# Altium schematic sheet Matrix.SchDoc
size A3; SheetNumber: 5; SheetTotal: 6
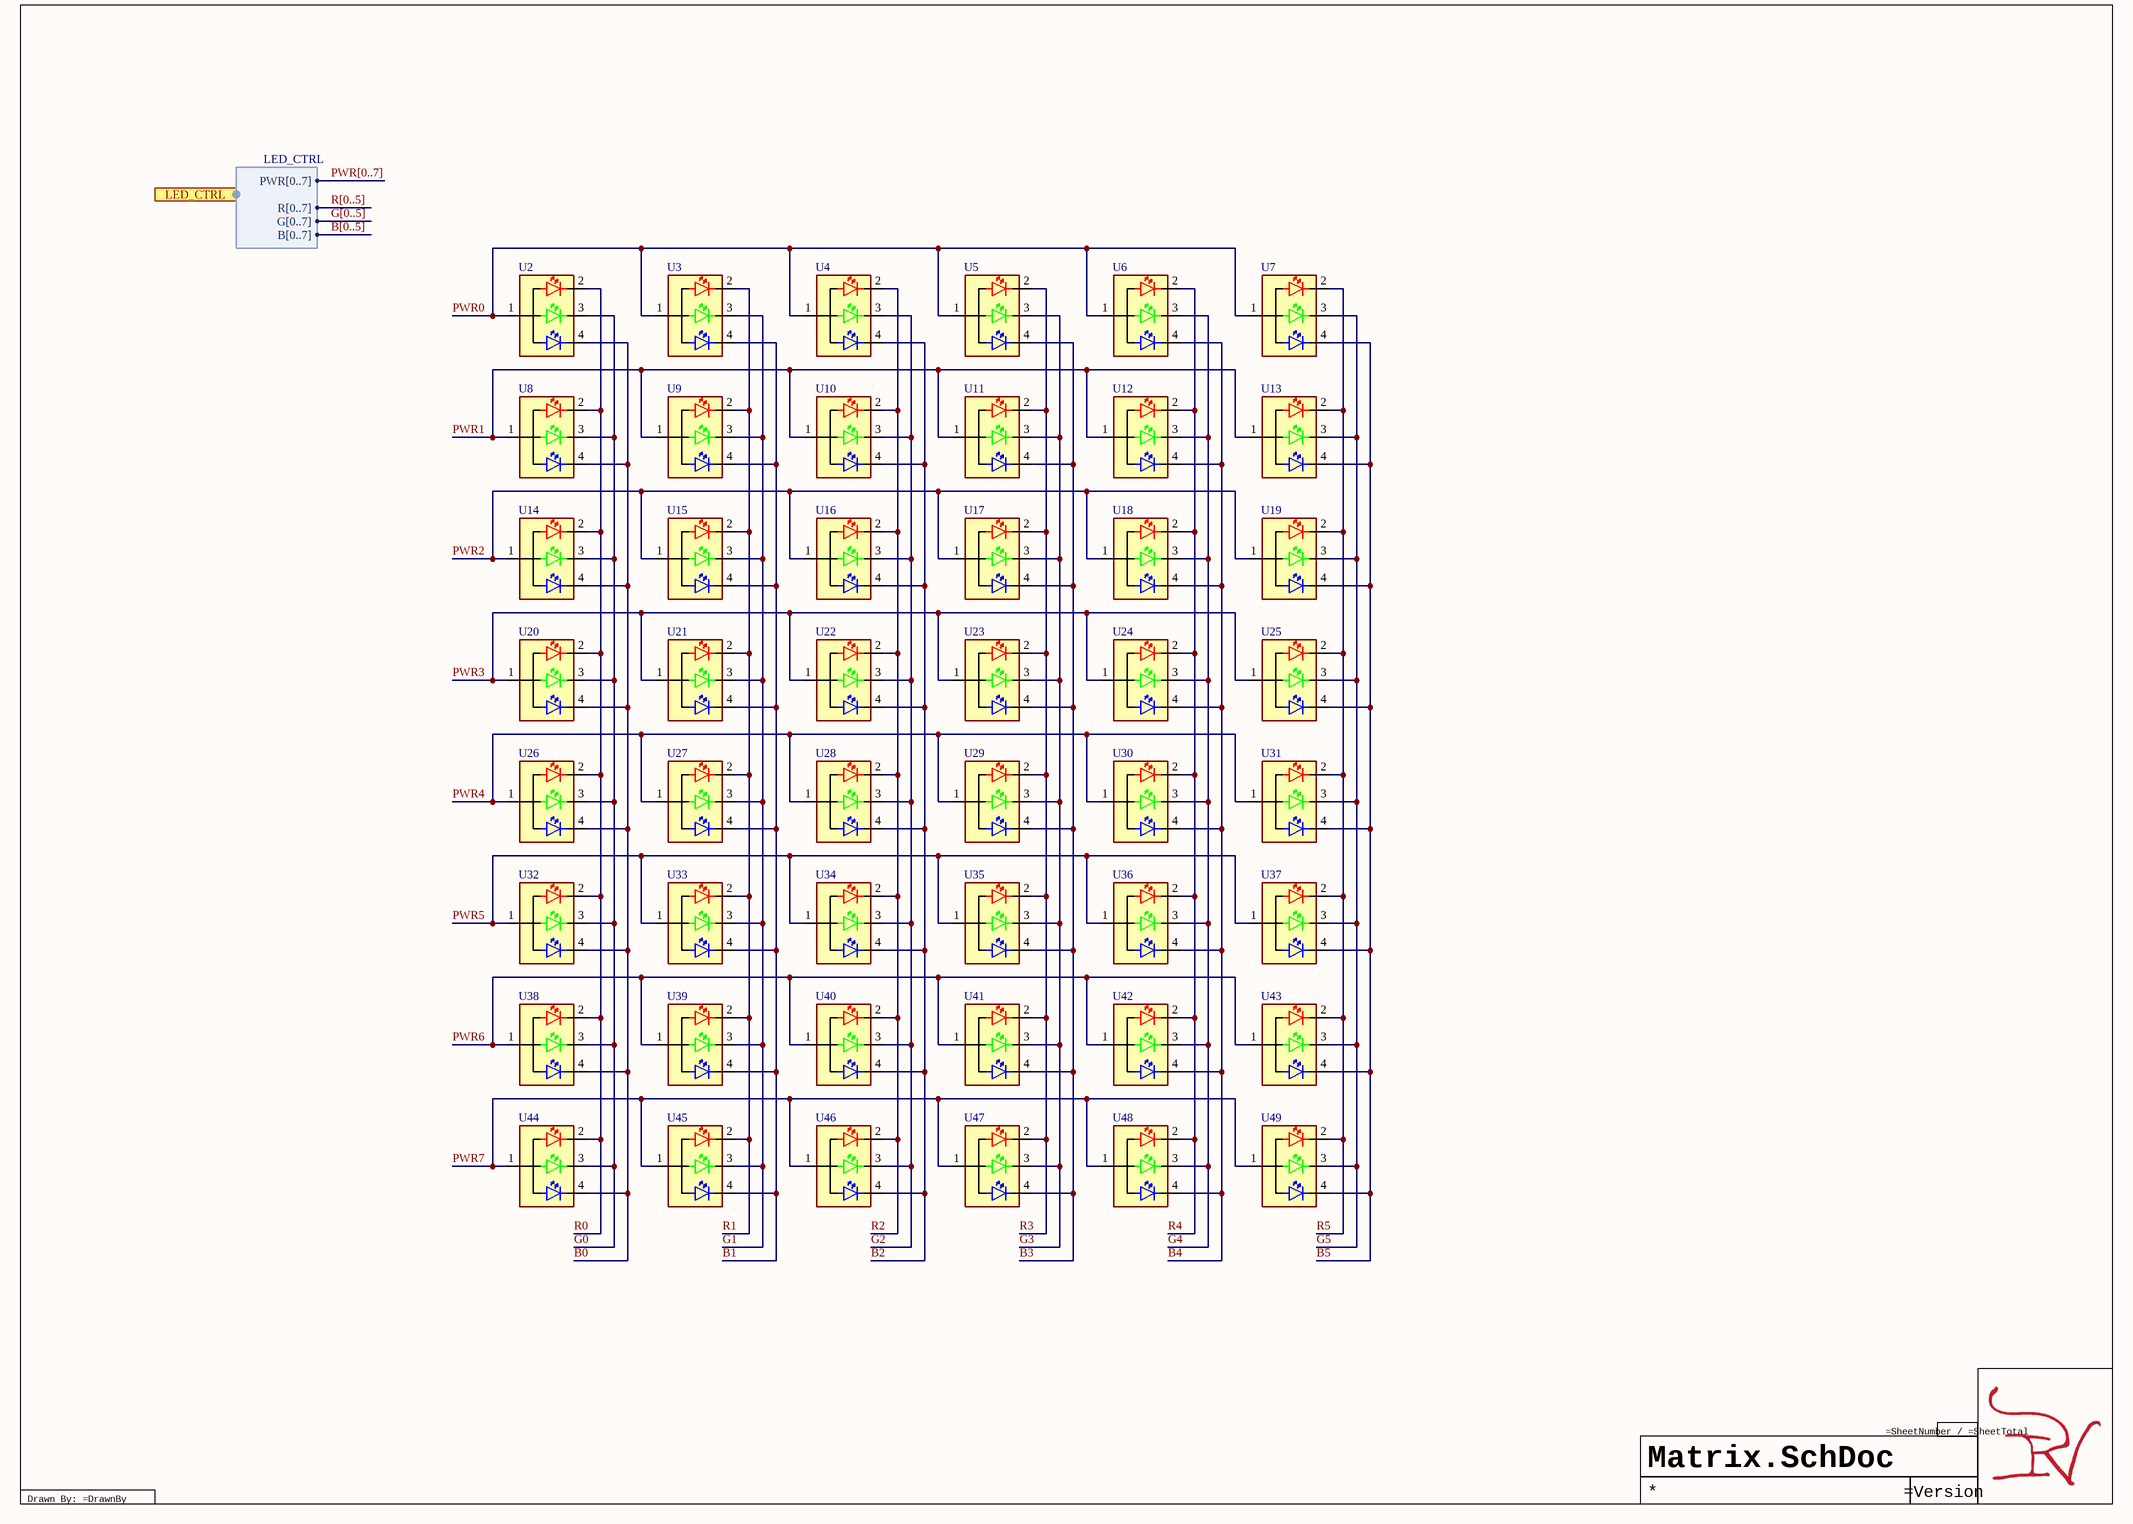
[diagram p0: Matrix.SchDoc]

## Parts
U2  B36J3RGB-F6C0001H4U1930  [B36J3RGB-F6C0001H4U1930-Footprint-1]  (value not drawn)
U3  B36J3RGB-F6C0001H4U1930  [B36J3RGB-F6C0001H4U1930-Footprint-1]  (value not drawn)
U4  B36J3RGB-F6C0001H4U1930  [B36J3RGB-F6C0001H4U1930-Footprint-1]  (value not drawn)
U5  B36J3RGB-F6C0001H4U1930  [B36J3RGB-F6C0001H4U1930-Footprint-1]  (value not drawn)
U6  B36J3RGB-F6C0001H4U1930  [B36J3RGB-F6C0001H4U1930-Footprint-1]  (value not drawn)
U7  B36J3RGB-F6C0001H4U1930  [B36J3RGB-F6C0001H4U1930-Footprint-1]  (value not drawn)
U8  B36J3RGB-F6C0001H4U1930  [B36J3RGB-F6C0001H4U1930-Footprint-1]  (value not drawn)
U9  B36J3RGB-F6C0001H4U1930  [B36J3RGB-F6C0001H4U1930-Footprint-1]  (value not drawn)
U10  B36J3RGB-F6C0001H4U1930  [B36J3RGB-F6C0001H4U1930-Footprint-1]  (value not drawn)
U11  B36J3RGB-F6C0001H4U1930  [B36J3RGB-F6C0001H4U1930-Footprint-1]  (value not drawn)
U12  B36J3RGB-F6C0001H4U1930  [B36J3RGB-F6C0001H4U1930-Footprint-1]  (value not drawn)
U13  B36J3RGB-F6C0001H4U1930  [B36J3RGB-F6C0001H4U1930-Footprint-1]  (value not drawn)
U14  B36J3RGB-F6C0001H4U1930  [B36J3RGB-F6C0001H4U1930-Footprint-1]  (value not drawn)
U15  B36J3RGB-F6C0001H4U1930  [B36J3RGB-F6C0001H4U1930-Footprint-1]  (value not drawn)
U16  B36J3RGB-F6C0001H4U1930  [B36J3RGB-F6C0001H4U1930-Footprint-1]  (value not drawn)
U17  B36J3RGB-F6C0001H4U1930  [B36J3RGB-F6C0001H4U1930-Footprint-1]  (value not drawn)
U18  B36J3RGB-F6C0001H4U1930  [B36J3RGB-F6C0001H4U1930-Footprint-1]  (value not drawn)
U19  B36J3RGB-F6C0001H4U1930  [B36J3RGB-F6C0001H4U1930-Footprint-1]  (value not drawn)
U20  B36J3RGB-F6C0001H4U1930  [B36J3RGB-F6C0001H4U1930-Footprint-1]  (value not drawn)
U21  B36J3RGB-F6C0001H4U1930  [B36J3RGB-F6C0001H4U1930-Footprint-1]  (value not drawn)
U22  B36J3RGB-F6C0001H4U1930  [B36J3RGB-F6C0001H4U1930-Footprint-1]  (value not drawn)
U23  B36J3RGB-F6C0001H4U1930  [B36J3RGB-F6C0001H4U1930-Footprint-1]  (value not drawn)
U24  B36J3RGB-F6C0001H4U1930  [B36J3RGB-F6C0001H4U1930-Footprint-1]  (value not drawn)
U25  B36J3RGB-F6C0001H4U1930  [B36J3RGB-F6C0001H4U1930-Footprint-1]  (value not drawn)
U26  B36J3RGB-F6C0001H4U1930  [B36J3RGB-F6C0001H4U1930-Footprint-1]  (value not drawn)
U27  B36J3RGB-F6C0001H4U1930  [B36J3RGB-F6C0001H4U1930-Footprint-1]  (value not drawn)
U28  B36J3RGB-F6C0001H4U1930  [B36J3RGB-F6C0001H4U1930-Footprint-1]  (value not drawn)
U29  B36J3RGB-F6C0001H4U1930  [B36J3RGB-F6C0001H4U1930-Footprint-1]  (value not drawn)
U30  B36J3RGB-F6C0001H4U1930  [B36J3RGB-F6C0001H4U1930-Footprint-1]  (value not drawn)
U31  B36J3RGB-F6C0001H4U1930  [B36J3RGB-F6C0001H4U1930-Footprint-1]  (value not drawn)
U32  B36J3RGB-F6C0001H4U1930  [B36J3RGB-F6C0001H4U1930-Footprint-1]  (value not drawn)
U33  B36J3RGB-F6C0001H4U1930  [B36J3RGB-F6C0001H4U1930-Footprint-1]  (value not drawn)
U34  B36J3RGB-F6C0001H4U1930  [B36J3RGB-F6C0001H4U1930-Footprint-1]  (value not drawn)
U35  B36J3RGB-F6C0001H4U1930  [B36J3RGB-F6C0001H4U1930-Footprint-1]  (value not drawn)
U36  B36J3RGB-F6C0001H4U1930  [B36J3RGB-F6C0001H4U1930-Footprint-1]  (value not drawn)
U37  B36J3RGB-F6C0001H4U1930  [B36J3RGB-F6C0001H4U1930-Footprint-1]  (value not drawn)
U38  B36J3RGB-F6C0001H4U1930  [B36J3RGB-F6C0001H4U1930-Footprint-1]  (value not drawn)
U39  B36J3RGB-F6C0001H4U1930  [B36J3RGB-F6C0001H4U1930-Footprint-1]  (value not drawn)
U40  B36J3RGB-F6C0001H4U1930  [B36J3RGB-F6C0001H4U1930-Footprint-1]  (value not drawn)
U41  B36J3RGB-F6C0001H4U1930  [B36J3RGB-F6C0001H4U1930-Footprint-1]  (value not drawn)
U42  B36J3RGB-F6C0001H4U1930  [B36J3RGB-F6C0001H4U1930-Footprint-1]  (value not drawn)
U43  B36J3RGB-F6C0001H4U1930  [B36J3RGB-F6C0001H4U1930-Footprint-1]  (value not drawn)
U44  B36J3RGB-F6C0001H4U1930  [B36J3RGB-F6C0001H4U1930-Footprint-1]  (value not drawn)
U45  B36J3RGB-F6C0001H4U1930  [B36J3RGB-F6C0001H4U1930-Footprint-1]  (value not drawn)
U46  B36J3RGB-F6C0001H4U1930  [B36J3RGB-F6C0001H4U1930-Footprint-1]  (value not drawn)
U47  B36J3RGB-F6C0001H4U1930  [B36J3RGB-F6C0001H4U1930-Footprint-1]  (value not drawn)
U48  B36J3RGB-F6C0001H4U1930  [B36J3RGB-F6C0001H4U1930-Footprint-1]  (value not drawn)
U49  B36J3RGB-F6C0001H4U1930  [B36J3RGB-F6C0001H4U1930-Footprint-1]  (value not drawn)

## Ports
LED_CTRL (harness LED_CTRL, see LEDMatrix[3B], Controller[1A])

## Harnesses
LED_CTRL: PWR[0..7], R[0..7], B[0..7], G[0..7]

## Nets
B0: U2.4 U8.4 U14.4 U20.4 U26.4 U32.4 U38.4 U44.4
B1: U3.4 U9.4 U15.4 U21.4 U27.4 U33.4 U39.4 U45.4
B2: U4.4 U10.4 U16.4 U22.4 U28.4 U34.4 U40.4 U46.4
B3: U5.4 U11.4 U17.4 U23.4 U29.4 U35.4 U41.4 U47.4
B4: U6.4 U12.4 U18.4 U24.4 U30.4 U36.4 U42.4 U48.4
B5: U7.4 U13.4 U19.4 U25.4 U31.4 U37.4 U43.4 U49.4
G0: U2.3 U8.3 U14.3 U20.3 U26.3 U32.3 U38.3 U44.3
G1: U3.3 U9.3 U15.3 U21.3 U27.3 U33.3 U39.3 U45.3
G2: U4.3 U10.3 U16.3 U22.3 U28.3 U34.3 U40.3 U46.3
G3: U5.3 U11.3 U17.3 U23.3 U29.3 U35.3 U41.3 U47.3
G4: U6.3 U12.3 U18.3 U24.3 U30.3 U36.3 U42.3 U48.3
G5: U7.3 U13.3 U19.3 U25.3 U31.3 U37.3 U43.3 U49.3
PWR0: U2.1 U3.1 U4.1 U5.1 U6.1 U7.1
PWR1: U8.1 U9.1 U10.1 U11.1 U12.1 U13.1
PWR2: U14.1 U15.1 U16.1 U17.1 U18.1 U19.1
PWR3: U20.1 U21.1 U22.1 U23.1 U24.1 U25.1
PWR4: U26.1 U27.1 U28.1 U29.1 U30.1 U31.1
PWR5: U32.1 U33.1 U34.1 U35.1 U36.1 U37.1
PWR6: U38.1 U39.1 U40.1 U41.1 U42.1 U43.1
PWR7: U44.1 U45.1 U46.1 U47.1 U48.1 U49.1
R0: U2.2 U8.2 U14.2 U20.2 U26.2 U32.2 U38.2 U44.2
R1: U3.2 U9.2 U15.2 U21.2 U27.2 U33.2 U39.2 U45.2
R2: U4.2 U10.2 U16.2 U22.2 U28.2 U34.2 U40.2 U46.2
R3: U5.2 U11.2 U17.2 U23.2 U29.2 U35.2 U41.2 U47.2
R4: U6.2 U12.2 U18.2 U24.2 U30.2 U36.2 U42.2 U48.2
R5: U7.2 U13.2 U19.2 U25.2 U31.2 U37.2 U43.2 U49.2

## Buses and harness runs
bus B[0..5]
bus G[0..5]
bus PWR[0..7]
bus R[0..5]

## Notes on the sheet
- Drawn By: =DrawnBy

## Library data of the parts
U2-U49 = CMP-007-00001-4: Led Rgb Common Anode (0.65(L)X 0